# EAGLE design OctoWatchSchemePackage2 (EAGLE 9.4.2)
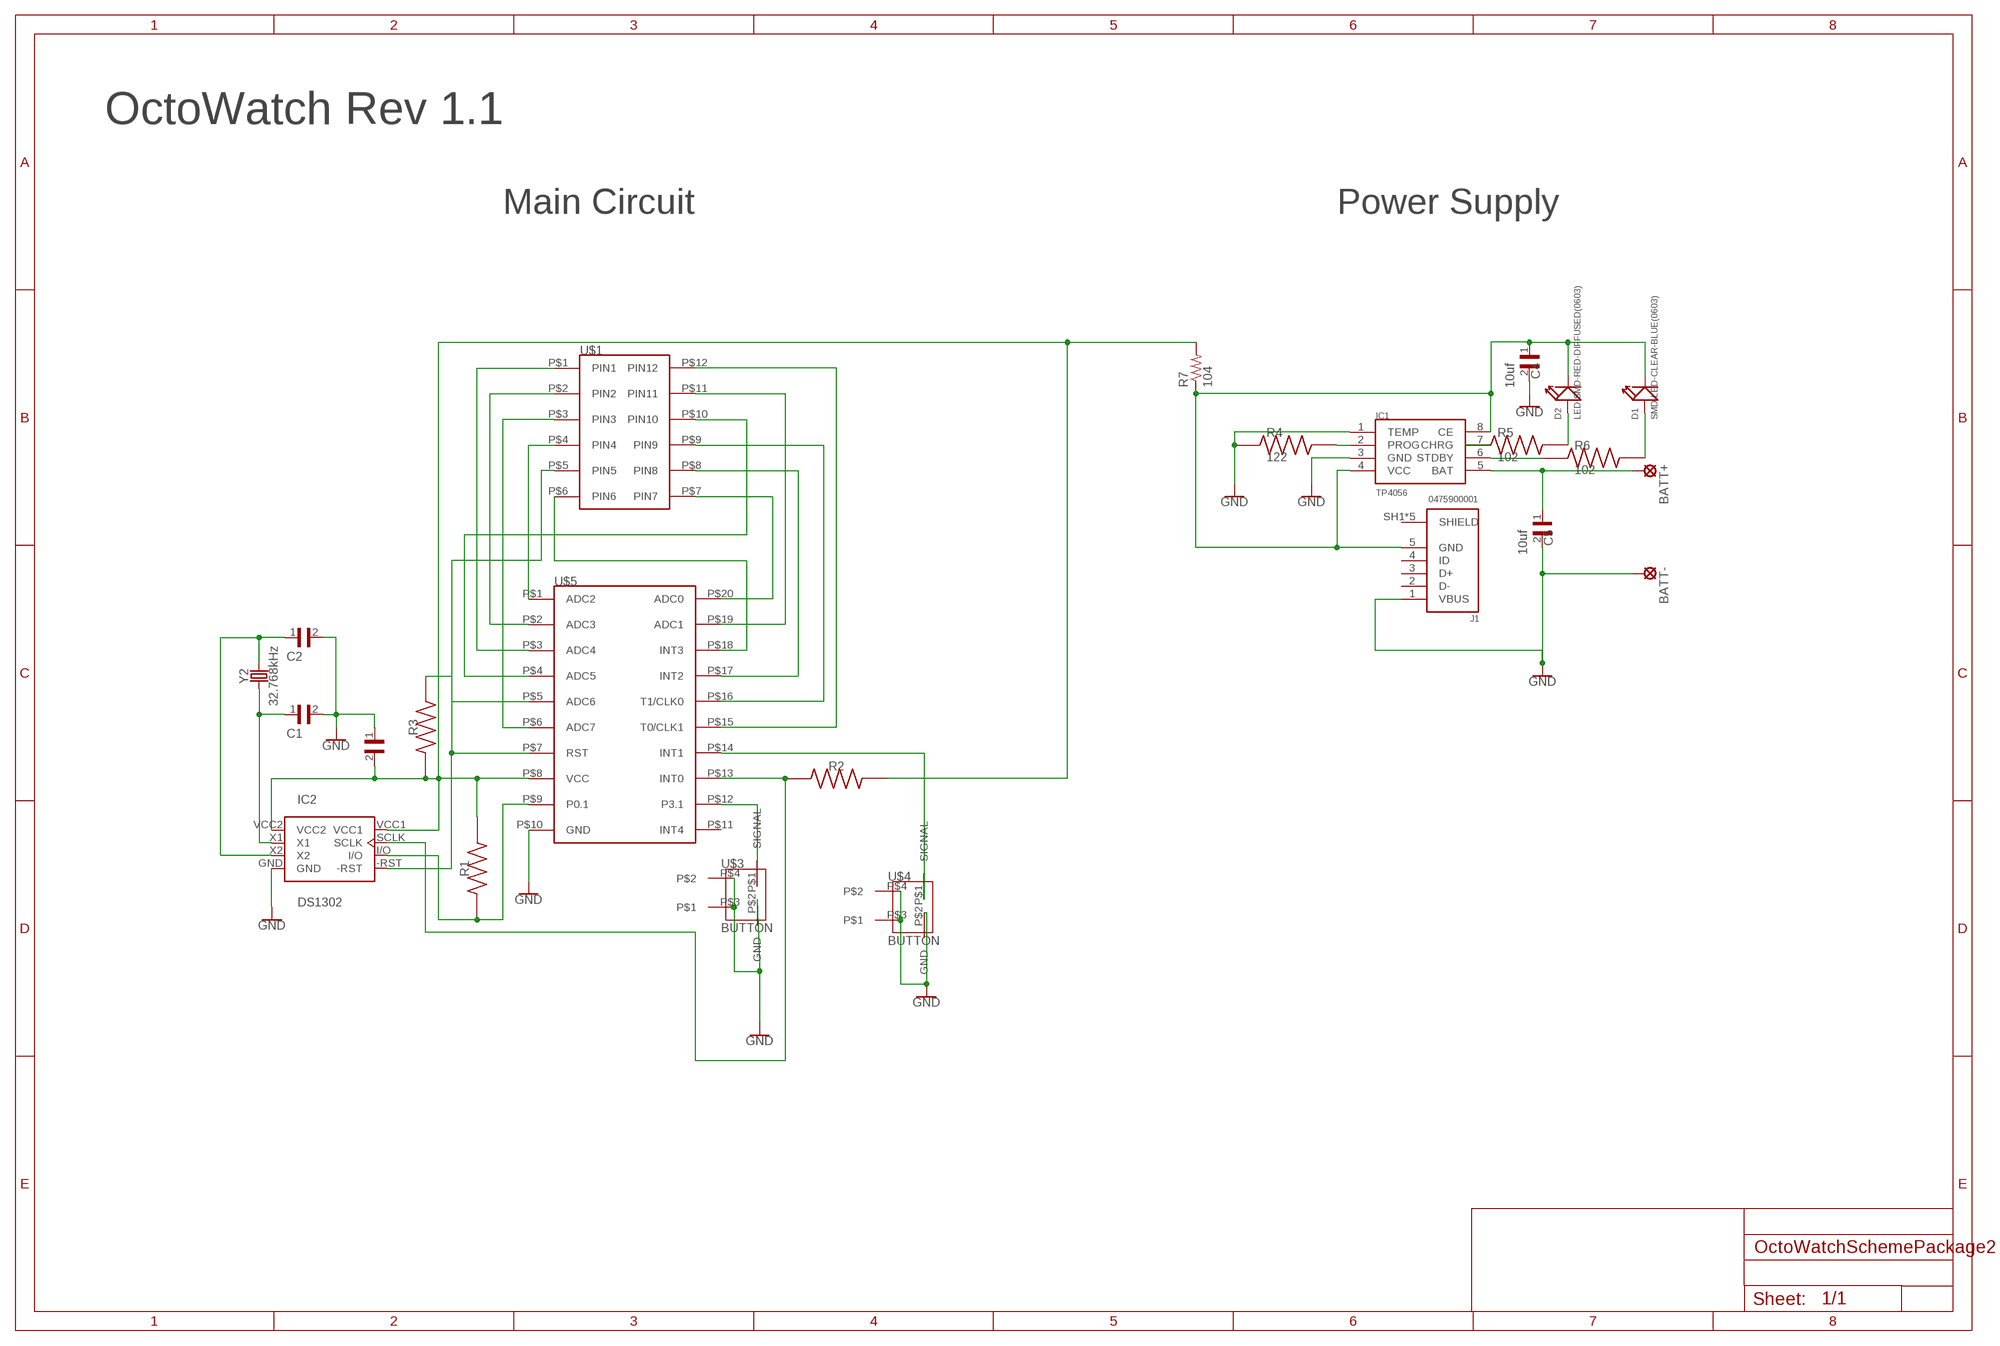
[diagram p0: schematic, sheet 1]

## Parts
BATT+  LSP13  [LSP13]
BATT-  LSP13  [LSP13]
C1  CL21C220JBANNNC  [CAPC2012X140N]
C2  CL21C220JBANNNC  [CAPC2012X140N]
C3  CL21B104KCFNNNE  [CAPC2012X140N]
C4  10uf  GRT188R61E106ME13D  [CAPC1608X100N]
C5  10uf  GRT188R61E106ME13D  [CAPC1608X100N]
D1  SMD-LED-CLEAR-BLUE(0603)  [LED-0603]
D2  LED-SMD-RED-DIFFUSED(0603)  [LED-0603]
IC1  TP4056  [SOP-8]
IC2  DS1302  [DIL08]
J1  0475900001  [0475900001]
R1  ERA3AEB103V  [RES_ERA3AEB103V]
R2  ERA3AEB103V  [RES_ERA3AEB103V]
R3  ERA3AEB103V  [RES_ERA3AEB103V]
R4  122  AC1206FR-073K9L  [RESC3116X65N]
R5  102  ERJ-PB3B1001V  [RESC1608X55N]
R6  102  ERJ-PB3B1001V  [RESC1608X55N]
R7  104  R-US_R0805  [R0805]
U$1  LED_SEGMENT  [LED_SEGMENT]
U$3  BUTTON  [BUTTON]
U$4  BUTTON  [BUTTON]
U$5  STC15F204AE  [STC15F204AE]
Y2  32.768kHz  CRYSTAL-32.768KHZPTH-2X6  [CRYSTAL-PTH-2X6-CYL]

## Nets
BATT+: C3.2 IC2.VCC1 IC2.VCC2 R1.2 R2.2 R3.1 R7.2 U$5.P$8(VCC)
GND: BATT-.MP C1.2 C2.2 C3.1 C4.2 C5.2 IC1.1(TEMP) IC1.3(GND) IC2.GND J1.1(VBUS) R4.1 U$3.P$2(GND) U$3.P$3 U$3.P$4 U$4.P$2(GND) U$4.P$3 U$4.P$4 U$5.P$10(GND)
N$1: U$1.P$1(PIN1) U$5.P$3(ADC4)
N$2: U$1.P$2(PIN2) U$5.P$2(ADC3)
N$3: U$1.P$4(PIN4) U$5.P$1(ADC2)
N$4: U$1.P$3(PIN3) U$5.P$6(ADC7)
N$5: U$1.P$5(PIN5) U$5.P$5(ADC6)
N$6: U$1.P$6(PIN6) U$5.P$18(INT3)
N$7: U$1.P$7(PIN7) U$5.P$20(ADC0)
N$8: U$1.P$8(PIN8) U$5.P$17(INT2)
N$9: U$1.P$9(PIN9) U$5.P$16(T1/CLK0)
N$10: IC2.SCLK R2.1 U$5.P$13(INT0)
N$11: IC2.-RST R3.2 U$5.P$7(RST)
N$12: U$1.P$12(PIN12) U$5.P$15(T0/CLK1)
N$13: C1.1 IC2.X1 Y2.1
N$14: C4.1 D1.- D2.- IC1.4(VCC) IC1.8(CE) J1.5(GND) R7.1
N$15: C2.1 IC2.X2 Y2.2
N$16: U$1.P$10(PIN10) U$5.P$4(ADC5)
N$17: IC2.I/O R1.1 U$5.P$9(P0.1)
N$18: BATT+.MP C5.1 IC1.5(BAT)
N$19: U$4.P$1(SIGNAL) U$5.P$14(INT1)
N$20: U$3.P$1(SIGNAL) U$5.P$12(P3.1)
N$21: U$1.P$11(PIN11) U$5.P$19(ADC1)
N$26: IC1.6(STDBY) R6.1
N$27: D1.+ R6.2
N$28: IC1.7(CHRG) R5.1
N$29: D2.+ R5.2
N$31: IC1.2(PROG) R4.2
Unconnected: J1.2(D-) J1.3(D+) J1.4(ID) U$5.P$11(INT4)

## Notes on the sheet
- OctoWatch Rev 1.1
- Main Circuit | Power Supply

## Power pins joined to a net without a drawn wire
SHIELD: J1.SH1(SHIELD) J1.SH2(SHIELD) J1.SH3(SHIELD) J1.SH4(SHIELD) J1.SH5(SHIELD)

## Library data of the parts
BATT+ BATT- = solpad:LSP13: SOLDER PAD drill 1.3 mm, distributor Buerklin, 12H562
C1 C2 = CL21C220JBANNNC:CL21C220JBANNNC: KC 22pF 0805 5% 50V NP0 Check prices <https://pricing.snapeda.com/parts/CL21C220JBANNNC/Samsung%20Electro-Mechanics/view-part?ref=eda>; AVAILABILITY: In Stock; DESCRIPTION: 22pF ±5% 50V Ceramic Capacitor C0G, NP0 0805 (2012 Metric); MF: Samsung Electro-Mechanics; MP: CL21C220JBANNNC; PACKAGE: 2012-2 Samsung; PRICE: None
C3 = CL21B104KCFNNNE:CL21B104KCFNNNE: CL21 Series 0.1 uF 100V ±10 % Tolerance X7R SMT Multilayer Ceramic Capacitor Check prices <https://pricing.snapeda.com/parts/CL21B104KCFNNNE/Samsung/view-part?ref=eda>; AVAILABILITY: In Stock; DESCRIPTION: 0.1µF ±10% 100V Ceramic Capacitor X7R 0805 (2012 Metric); MF: Samsung; MP: CL21B104KCFNNNE; PACKAGE: 0805 Samsung; PRICE: None
C4 C5 = GRT188R61E106ME13D:GRT188R61E106ME13D: Cap Ceramic 10uF 25V X5R 20% Pad SMD 0603 85C Automotive T/R Check prices <https://pricing.snapeda.com/parts/GRT188R61E106ME13D/Murata/view-part?ref=eda>; AVAILABILITY: In Stock; DESCRIPTION: SMD Capacitor X5R(EIA) with Capacitance: 10uF Tol. 20%. Rated Voltage: 25Vdc; MF: Murata; MP: GRT188R61E106ME13D; PACKAGE: 1608 Murata; PRICE: None
D1 = SMD-LED-CLEAR-BLUE_0603_:SMD-LED-CLEAR-BLUE(0603): 304090045 Check prices <https://pricing.snapeda.com/parts/19-217/BHC-ZL1M2RY/3T/Everlight/view-part?ref=eda>; AVAILABILITY: Not in stock; DESCRIPTION: Blue LED Indication - Discrete 2.8V 0603 (1608 Metric); MF: Everlight; MP: 19-217/BHC-ZL1M2RY/3T; PACKAGE: 0603 Everlight; PRICE: None
D2 = LED-SMD-RED-DIFFUSED_0603_:LED-SMD-RED-DIFFUSED(0603): 304090042 Check prices <https://pricing.snapeda.com/parts/19-217/R6C-AL1M2VY/3T/Everlight%20Electronics/view-part?ref=eda>; AVAILABILITY: In Stock; DESCRIPTION: Red LED Indication - Discrete 1.95V 0603 (1608 Metric); MF: Everlight Electronics; MP: 19-217/R6C-AL1M2VY/3T; PACKAGE: 0603 Everlight Electronics; PRICE: None
IC1 = TP4056:TP4056
IC2 = ds1302:DS1302: Real-time clock (RTC) counts seconds, minutes hours, date of the month, month, day of the week, and year with leap-year compensation valid up to 2100
J1 = USB connector:0475900001: CONN RCPT MICRO USB AB 5P SMD RA Manufacturer's datasheet <https://www.molex.com/pdm_docs/sd/475900001_sd.pdf>; CREATED_BY: PCBLayout.com; DIGIKEY_PARTNO: WM17144TR-ND; MANUFACTURER: Molex; MPN: 0475900001
R1-R3 = ERA3AEB103V:ERA3AEB103V: Check prices <https://pricing.snapeda.com/parts/ERA3AEB103V/Panasonic/view-part?ref=eda>; AVAILABILITY: No availability data; DESCRIPTION: 10 kOhms ±0.1% 0.1W, 1/10W Chip Resistor 0603 (1608 Metric) Automotive AEC-Q200 Thin Film; MF: Panasonic; MP: ERA3AEB103V; PACKAGE: 1608-2 Panasonic; PRICE: None
R4 = AC1206FR-073K9L:AC1206FR-073K9L: AC1206 3,90K 1% 0,25W AUTOMO Check prices <https://pricing.snapeda.com/parts/AC1206FR-073K9L/Yageo/view-part?ref=eda>; AVAILABILITY: In Stock; DESCRIPTION: Res Thick Film 1206 3.9K Ohm 1% 0.25W(1/4W) ±100ppm/°C Pad SMD Automotive T/R; MF: Yageo; MP: AC1206FR-073K9L; PACKAGE: 3116 Yageo; PRICE: None
R5 R6 = ERJ-PB3B1001V:ERJ-PB3B1001V: Res Thick Film 0603 1K Ohm 0.1% 0.2W(1/5W) ±50ppm/C Pad SMD Automotive T/R Check prices <https://pricing.snapeda.com/parts/ERJ-PB3B1001V/Panasonic%20Electronic/view-part?ref=eda>; AVAILABILITY: In Stock; DESCRIPTION: 1 kOhms ±0.1% 0.2W, 1/5W Chip Resistor 0603 (1608 Metric) Automotive AEC-Q200, Pulse Withstanding Thick Film; MF: Panasonic Electronic; MP: ERJ-PB3B1001V; PACKAGE: 1608 Panasonic Electronic Components; PRICE: None
R7 = rcl:R-US_: RESISTOR, American symbol; SPICEPREFIX: R
U$1 = OctoWatch:LED_SEGMENT: 7 segment led LCD 7mm
U$3 U$4 = OctoWatch:BUTTON
U$5 = OctoWatch:STC15F204AE: 15L204AE microchip for watch
Y2 = SparkFun-Clocks:CRYSTAL-32.768KHZ: 32.768kHz Crystal Frequency: 32.768kHz Frequency Stability: ±20ppm Load Capacitance: 12.5pF (PTH-2X6 & SMD-3.2X1.5), 6pF (SMD-2X6) SparkFun Products: SparkFun BigTime Watch Kit <https://www.sparkfun.com/products/11734> SparkFun nRF52832 Breakout <https://www.sparkfun.com/products/13990> SparkFun Real Time Clock Module <https://www.sparkfun.com/products/12708>; PROD_ID: XTAL-10112

## Board
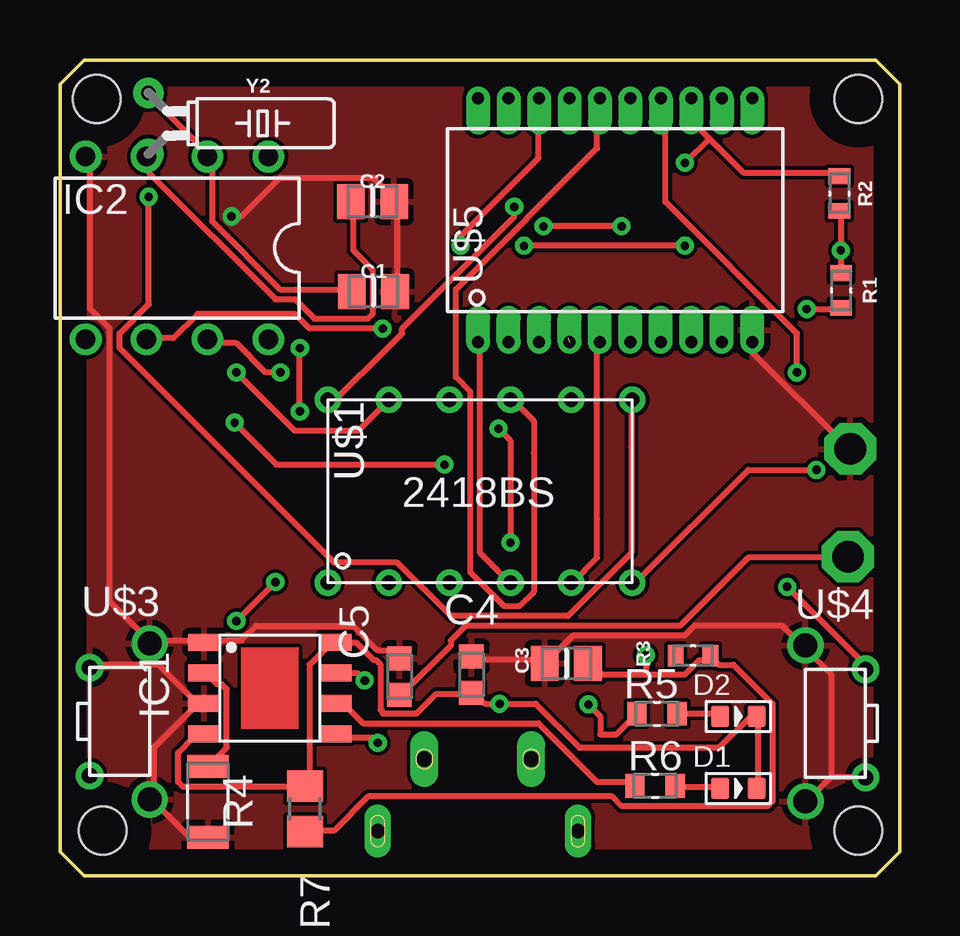
[diagram p1: board, top side]
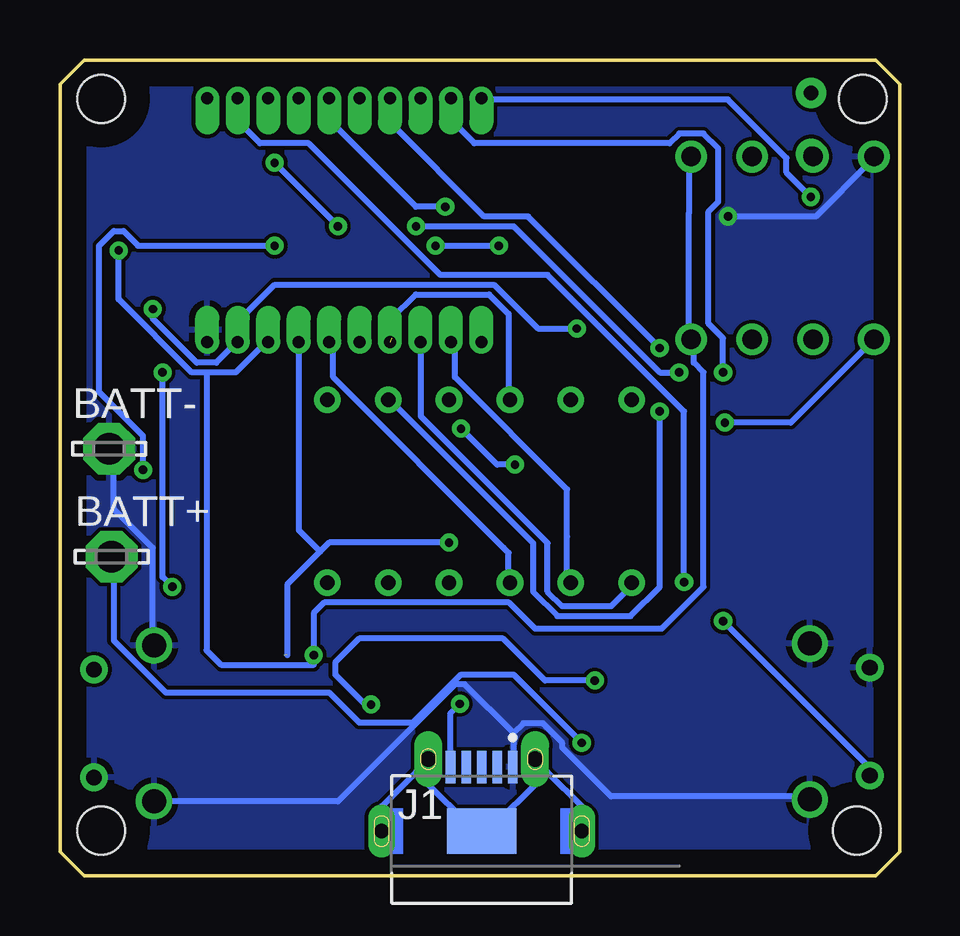
[diagram p2: board, bottom side, seen from below]

Size 35 x 34 mm. Coordinates in mm from the lower left corner, seen from the top.
Outline: 0,33 0,1 1,0 34,0 35,1 35,33 34,34 1,34 0,33
Copper layers (1*16): Top 0.035mm / dielectric 1.5mm / Bottom 0.035mm
Design rules "default *": minimum track width 10mil, minimum drill 0.35mm, track to track 6mil, track to pad 6mil, pad to pad 6mil, via to via 6mil, smd to smd 6mil, copper to edge 40mil, drill to drill 6mil, minimum pad ring 10mil, minimum via ring 8mil, stop-mask expansion 4mil, vias tented up to drill 0mil, thermal gap 10mil
Holes 2 mm at 33.28,32.38 1.53,32.38 1.78,1.88 33.28,1.88

### Footprints (pad centres in the part's own frame; a part is rotated, then mirrored left to right if it is on the bottom)
LSP13 = drill 1.321 pad 2.159 octagon: MP 0,0
CAPC2012X140N = smd 1.15 x 1.45: 1 -0.9,0; 2 0.9,0
CAPC1608X100N = smd 1 x 1.02: 1 -0.759,0; 2 0.759,0
LED-0603 = smd 0.762 x 0.889: + -0.762,0; - 0.762,0
SOP-8 = smd 1.3 x 0.7: 1 -2.75,1.905; 2 -2.75,0.635; 3 -2.75,-0.635; 4 -2.75,-1.905; 5 2.75,-1.905; 6 2.75,-0.635; 7 2.75,0.635; 8 2.75,1.905
DIL08 = drill 0.813: -RST 3.81,3.81; GND 3.81,-3.81; I/O 1.27,3.81; SCLK -1.27,3.81; VCC1 -3.81,3.81; VCC2 -3.81,-3.81; X1 -1.27,-3.81; X2 1.27,-3.81
0475900001 = smd 0.4 x 1.35: 1 1.3,2.675; 2 0.65,2.675; 3 0,2.675; 4 -0.65,2.675; 5 -1.3,2.675 | drill 0.65 pad 0.85 long: SH1 -2.225,3; SH2 2.225,3 | drill 0.6 pad 0.8 long: SH3 -4.175,0; SH4 4.175,0 | smd 2.9 x 1.9: SH5 0,0
RES_ERA3AEB103V = smd 0.65 x 0.9: 1 -0.725,0; 2 0.725,0
RESC3116X65N = smd 0.97 x 1.73: 1 -1.48,0; 2 1.48,0
RESC1608X55N = smd 0.8 x 0.98: 1 -0.837,0; 2 0.837,0
R0805 = smd 1.3 x 1.5: 1 -0.95,0; 2 0.95,0
LED_SEGMENT = drill 0.6: P$1 -12.7,7.62; P$2 -12.7,5.08; P$3 -12.7,2.54; P$4 -12.7,0; P$5 -12.7,-2.54; P$6 -12.7,-5.08; P$7 -5.08,-5.08; P$8 -5.08,-2.54; P$9 -5.08,0; P$10 -5.08,2.54; P$11 -5.08,5.08; P$12 -5.08,7.62
BUTTON = drill 0.65: P$1 -9,4.5; P$2 -9,0 | drill 1: P$3 -11.5,-1; P$4 -11.5,5.5
STC15F204AE = drill 0.5 pad 0.813 offset: P$1 -40.64,6.35; P$2 -40.64,5.08; P$3 -40.64,3.81; P$4 -40.64,2.54; P$5 -40.64,1.27; P$6 -40.64,0; P$7 -40.64,-1.27; P$8 -40.64,-2.54; P$9 -40.64,-3.81; P$10 -40.64,-5.08; P$11 -30.48,-5.08; P$12 -30.48,-3.81; P$13 -30.48,-2.54; P$14 -30.48,-1.27; P$15 -30.48,0; P$16 -30.48,1.27; P$17 -30.48,2.54; P$18 -30.48,3.81; P$19 -30.48,5.08; P$20 -30.48,6.35
CRYSTAL-PTH-2X6-CYL = drill 0.6 pad 1.27: 1 -1.27,0; 2 1.27,0

### Placement (x,y rotation side)
BATT+  32.85,13.29 0 bottom
BATT-  32.95,17.79 0 bottom
C1  13.07,24.34 0 top
C2  13.03,28.09 0 top
C3  21.11,8.84 0 top
C4  17.15,8.37 90 top
C5  14.15,8.29 90 top
D1  28.28,3.63 0 top
D2  28.28,6.63 0 top
IC1  8.75,7.81 0 top
IC2  4.88,26.16 180 top
J1  17.42,1.85 0 bottom
R1  32.57,24.39 90 top
R2  32.49,28.43 270 top
R3  26.39,9.17 180 top
R4  6.17,3.07 90 top
R5  24.89,6.74 0 top
R6  24.81,3.74 0 top
R7  10.21,2.78 270 top
U$1  18.78,24.91 90 top
U$3  -7.76,8.67 180 top
U$4  42.58,4.09 0 top
U$5  23.78,62.88 90 top
Y2  3.69,31.36 270 top

### Tracks (layer width: path | path; a pad name or v marks a point on that pad's centre or on a via)
BATT+  (via drill 0.35)
  Top 0.254: 24.43,8.38 22.6,8.38 22.19,8.78 C3.2 | 24.43,8.38 26.05,8.38 26.66,8.99 27.07,8.99 R3.1 27.27,8.99 27.47,8.78 28.08,8.78 29.71,7.16 29.71,3.09 29.51,2.89 23.41,2.89 23,3.3 12.84,3.3 11.42,1.87 10.4,1.87 R7.2 | R1.2 32.55,25.24 v32.55,26.05 32.55,27.68 R2.2 | v24.43,9.19 24.43,8.38
  Bottom 0.254: IC2.VCC2 8.78,29.91 8.78,27.63 8.78,22.4 IC2.VCC1 8.58,22.19 8.58,21.38 8.17,20.97 8.17,12.03 9.92,10.28 15.18,10.28 16.28,11.38 23.99,11.38 24.43,10.94 v24.43,9.19 24.43,8.78 28.29,8.78 28.9,9.39 28.9,20.97 | v32.55,26.05 32.55,24.02 29.51,20.97 28.9,20.97 | 28.9,20.97 27.68,20.97 26.46,22.19 U$5.P$8
GND  (via drill 0.35)
  Top 0.254: 14.11,9.35 C5.2 | 14.31,9.35 C5.2 | 16.95,9.35 C4.2 17.31,8.99 20.16,8.99 C3.1 20.36,8.99 21.38,10 26.05,10 26.46,10.41 30.11,10.41 30.93,9.6 U$4.P$4 31.13,9.39 32.15,8.38 32.15,4.11 | 5.57,7.39 IC1.3 | U$5.P$10 28.9,22.19 28.9,21.79 32.76,17.93 BATT-.MP | 32.15,4.11 33.57,4.11 U$4.P$2 | 32.15,4.11 31.13,3.09 U$4.P$3 | R4.1 6.14,1.67 5.32,1.67 3.9,3.09 U$3.P$4 3.9,3.3 3.9,5.33 5.73,7.16 IC1.3 | C5.2 14.06,9.39 13.25,9.39 12.23,10.41 8.17,10.41 7.56,9.8 6.14,9.8 IC1.1 5.93,9.8 3.9,9.8 U$3.P$3 | C1.2 14.06,24.43 14.06,28.09 C2.2 13.86,28.29 13.05,29.1 9.19,29.1 7.56,27.48 v7.15,27.48 | 4.11,8.78 3.9,8.99 3.9,9.6 U$3.P$3 | 4.11,8.78 5.53,7.36 IC1.3 | 4.11,8.78 1.26,8.78 U$3.P$2 | IC2.GND 1.26,29.91 1.26,23.62 2.07,22.8 2.07,11.42 3.7,9.8 U$3.P$3
  Bottom 0.254: BATT-.MP 32.76,17.72 32.76,15.29 31.13,13.66 31.13,9.6 U$4.P$4 | 16.09,5.94 16.09,4.72 J1.1 | 16.09,5.94 15.69,6.34 14.87,6.34 14.06,5.53 14.06,5.33 12.03,3.3 3.9,3.3 U$3.P$4 | v7.15,27.48 3.5,27.48 1.26,29.71 1.26,29.91 IC2.GND | 16.09,5.94 18.13,7.97 18.53,7.97 23.41,3.09 30.93,3.09 U$4.P$3
  pour Top: 1.03,33.88 33.78,33.88 34.78,32.88 34.78,1.13 33.78,0.13 1.28,0.13 0.28,1.13 0.28,33.13
  pour Bottom: 1.03,33.88 33.78,33.88 34.78,32.88 34.78,1.13 33.78,0.13 1.03,0.13 0.28,0.88 0.28,33.13 0.78,33.63
N$1
  Bottom 0.254: U$5.P$3 19.95,22.19 19.95,20.88 19.95,19.15 14.67,13.86 14.67,11.83 14.06,11.22 13.28,11.22 12.03,11.22 11.22,12.03 U$1.P$1
N$2
  Bottom 0.254: U$5.P$2 18.53,22.19 18.53,20.77 13.86,16.1 13.86,14.13 13.86,12.24 U$1.P$2
N$3
  Top 0.254: U$5.P$1 17.52,22.19 17.52,13.46 18.19,12.79 18.73,12.24 U$1.P$4
N$4
  Bottom 0.254: U$5.P$6 23.61,22.19 23.61,20.77 16.5,13.66 16.3,13.46 16.3,12.24 U$1.P$3
N$5
  Top 0.254: U$5.P$5 22.39,22.19 22.39,14.88 22.39,13.25 21.38,12.24 U$1.P$5
N$6  (via drill 0.35)
  Top 0.254: v16.7,26.26 16.7,26.66 19.95,29.91 19.95,32.35 U$5.P$18 | v26.05,26.26 v19.34,26.26 | v31.54,16.91 28.69,16.91 24.02,12.24 U$1.P$6
  Bottom 0.254: v19.34,26.26 v16.7,26.26 | v26.05,26.26 31.74,26.26 32.35,26.87 32.76,26.87 33.37,26.26 33.37,20.16 31.54,18.33 v31.54,16.91
N$7  (via drill 0.35)
  Top 0.254: v3.7,28.29 3.7,23.82 2.48,22.6 2.48,21.99 11.42,13.05 14.06,13.05 16.3,10.81 21.17,10.81 23.81,13.46 23.81,17.88 23.81,19.75 U$1.P$7
  Bottom 0.254: v3.7,28.29 4.71,29.31 4.71,29.91 7.15,32.35 17.31,32.35 U$5.P$20
N$8  (via drill 0.35)
  Top 0.254: v10,19.35 v10,21.99
  Bottom 0.254: v10,21.99 15.48,27.48 17.31,27.48 21.17,31.34 21.17,32.35 U$5.P$17 | v10,19.35 10,12.03 11.22,10.81 14.27,10.81 15.28,11.83 15.28,13.86 20.66,19.25 21.17,19.75 U$1.P$8
N$9
  Top 0.254: U$5.P$16 22.39,32.35 22.39,30.32 16.5,24.43 16.5,20.77 17.11,20.16 17.11,12.64 18.53,11.22 19.14,11.22 19.75,11.83 19.75,17.63 19.75,18.94 18.94,19.75 U$1.P$9
N$10  (via drill 0.35)
  Top 0.254: 27.07,30.73 26.46,31.34 26.46,32.35 U$5.P$13 | 27.07,30.73 28.49,29.31 32.35,29.31 R2.1 | v9.19,20.97 8.58,20.97 7.36,22.19 6.34,22.19 IC2.SCLK | v23.41,27.07 v20.16,27.07 | 27.07,30.73 v26.05,29.71
  Bottom 0.254: v9.19,20.97 10,20.97 16.09,27.07 v20.16,27.07 | v26.05,29.71 v23.41,27.07
N$11  (via drill 0.35)  (1 unrouted)
  Top 0.254: v7.28,18.88 9.03,17.13 v16.03,17.13 | v18.28,18.63 18.78,18.13 v18.78,13.88
  Bottom 0.254: IC2.-RST 4.54,18.88 v7.28,18.88 | v16.03,17.13 16.78,17.13 v18.28,18.63 | v18.78,13.88 23.78,13.88 24.16,13.5 | 24.16,13.5 25.53,12.13 25.53,9.19 | U$5.P$7 25.05,14.4 24.16,13.5
N$12  (via drill 0.35)
  Top 0.254: v18.94,27.88 18.94,27.48 14.27,22.8 14.27,22.6 13.54,21.87 11.62,19.96 11.22,19.96 U$1.P$12
  Bottom 0.254: v18.94,27.88 20.16,27.88 23.61,31.34 23.61,32.35 U$5.P$15
N$13
  Top 0.254: C1.1 12.03,24.43 9.19,24.43 6.34,27.27 6.34,29.91 IC2.X1 6.14,30.12 3.7,32.56 Y2.1
N$14  (via drill 0.35)
  Top 0.254: 6.18,5.77 IC1.4 5.93,5.73 5.53,5.73 4.92,5.12 4.92,3.91 5.12,3.7 10.2,3.7 R7.1 10.4,3.91 10.4,8.78 11.42,9.8 IC1.8 | D1.- 29.1,3.7 29.1,6.55 D2.- 28.79,6.63 27.48,5.31 21.67,5.31 19.83,7.16 v18.33,7.16 17.72,7.16 17.31,7.56 C4.1 17.11,7.56 15.69,7.56 14.87,6.75 13.45,6.75 13.45,6.82 13.36,6.91 13.36,8.8 13.17,8.99 13.08,8.99 12.35,9.71 IC1.8 | 11.62,9.8 IC1.8
  Bottom 0.254: v18.33,7.16 18.73,6.75 18.73,6.38 18.73,5.88 18.73,4.72 J1.5
N$15
  Top 0.254: C2.1 12.23,28.09 12.23,26.05 13.05,25.24 13.05,23.41 12.84,23.21 10.61,23.21 9.79,24.02 8.98,24.02 3.7,29.31 3.7,29.91 Y2.2 3.7,30.12 IC2.X2
N$16  (1 unrouted)
  Bottom 0.254: 21.17,22.4 21.17,23.21 20.16,24.23 17.11,24.23 16.3,23.41 16.3,22.13 16.3,19.96 U$1.P$10
N$17  (via drill 0.35)
  Top 0.254: v31.13,23.62 32.55,23.62 R1.1 | v13.45,22.8 10.4,22.8 9.79,23.41 5.73,23.41 4.71,22.4 3.7,22.4 IC2.I/O
  Bottom 0.254: v31.13,23.62 31.13,23.21 29.3,21.38 28.49,21.38 27.68,22.19 U$5.P$9 27.47,22.4 27.47,23.21 26.05,24.63 16.91,24.63 15.08,22.8 v13.45,22.8
N$18  (via drill 0.35)
  Top 0.254: 11.67,5.77 IC1.5 11.62,5.73 13.05,5.73 v13.25,5.53 | C5.1 14.27,7.56 16.3,9.6 16.3,9.8 16.91,10.41 25.85,10.41 28.69,13.25 32.76,13.25 BATT+.MP
  Bottom 0.254: v13.25,5.53 16.09,8.38 18.28,8.38 20.28,6.38 22.53,6.38 23.78,7.63 30.58,7.63 32.76,9.8 32.76,13.25 BATT+.MP
N$19  (via drill 0.35)
  Top 0.254: v30.72,20.97 30.72,22.6 25.24,28.09 25.24,32.35 U$5.P$14 | v30.32,12.03 33.57,8.78 U$4.P$1
  Bottom 0.254: v30.72,20.97 30.72,12.44 v30.32,12.03
N$20  (via drill 0.35)
  Top 0.254: v7.36,10.61 v8.98,12.24
  Bottom 0.254: v8.98,12.24 8.98,19.35 14.67,25.04 19.14,25.04 24.63,30.53 26.66,30.53 27.47,31.34 27.47,32.35 U$5.P$12 | v7.36,10.61 1.26,4.52 1.26,4.31 U$3.P$1
N$21  (via drill 0.35)
  Top 0.254: v7.36,20.97 9.79,18.54 12.44,18.54 12.66,18.75 13.66,19.75 U$1.P$11
  Bottom 0.254: v7.36,20.97 7.36,22.4 7.97,23.01 7.97,27.68 7.56,28.09 7.56,30.32 8.17,30.93 9.19,30.93 9.59,30.53 17.72,30.53 18.53,31.34 18.53,32.35 U$5.P$19
N$26
  Top 0.254: 24.22,3.78 R6.1 23.81,3.91 22.39,3.91 19.95,6.34 12.64,6.34 11.62,7.36 IC1.6
N$27
  Top 0.254: 25.44,3.78 R6.2 25.85,3.7 27.47,3.7 D1.+
N$28  (via drill 0.35)
  Top 0.254: IC1.7 11.67,8.41 | 11.67,8.61 IC1.7 | IC1.7 12.39,8.45 v12.7,8.13 | v22.03,7.13 22.53,6.63 22.53,5.88 23.19,5.88 R5.1
  Bottom 0.254: v12.7,8.13 14.78,8.13 16.53,9.88 22.53,9.88 23.53,8.88 23.53,8.38 22.28,7.13 v22.03,7.13
N$29
  Top 0.254: 25.44,6.67 R5.2 25.85,6.75 27.47,6.75 D2.+
N$31
  Top 0.254: 6.18,8.41 IC1.2 6.14,8.38 6.54,7.97 6.75,7.97 6.95,7.77 6.95,5.33 6.34,4.72 R4.2
SHIELD
  Bottom 0.254: 20.16,4.31 19.75,4.72 J1.SH1 20.16,4.31 | 20.16,4.31 21.58,2.89 21.58,1.87 J1.SH3 | 14.67,4.31 15.08,4.72 J1.SH2 14.67,4.31 | 14.67,4.31 13.25,2.89 13.25,1.87 J1.SH4 | 14.67,4.31 17.31,1.67 J1.SH5 17.52,1.67 20.16,4.31